# Altium project CLP.PrjPCB
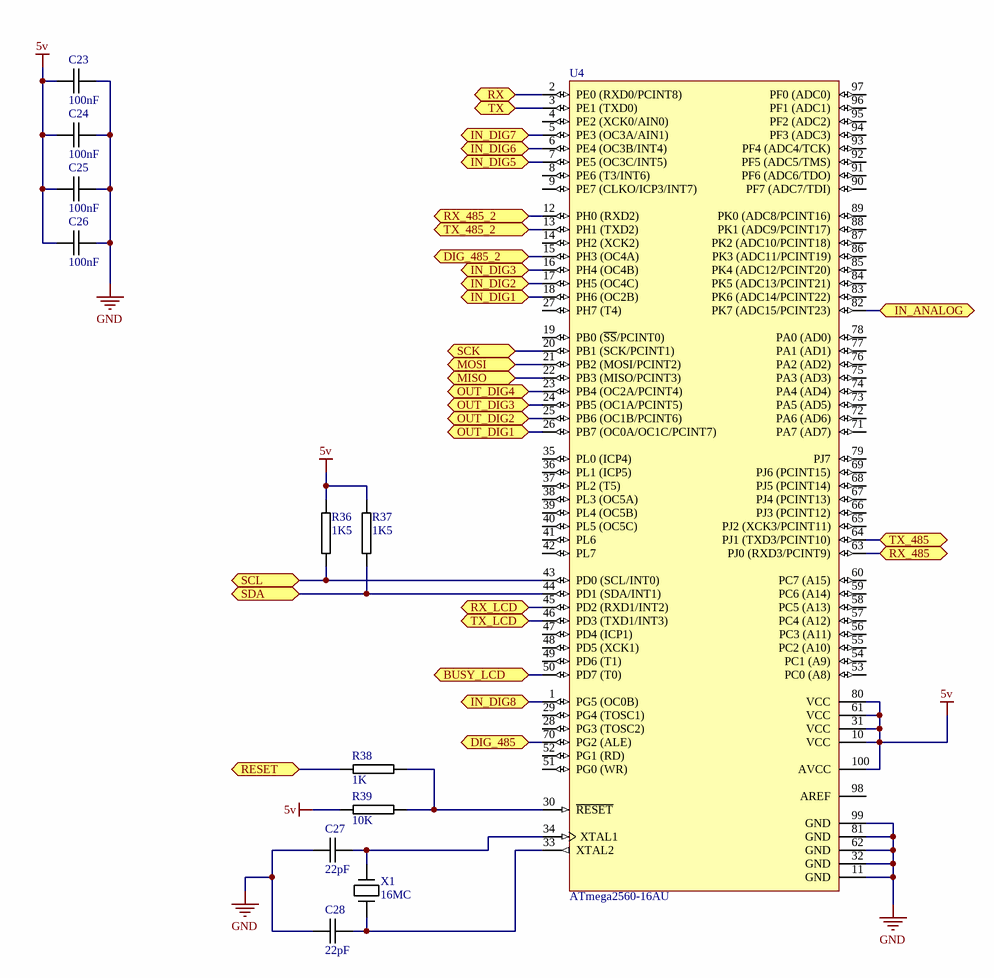
[diagram p0: Microcontrolador.SchDoc]
11 sheets, 153 parts. Net scope: flat (ports and power ports of the same name join across sheets).
Sheets:
  Microcontrolador.SchDoc
  Alimentacao.SchDoc
  Output_dig.SchDoc
  Output_dig2.SchDoc
  Input_dig.SchDoc
  Comu_485.SchDoc
  USB_SERIAL.SchDoc
  eeprom24c32.SchDoc
  RTC_ds1307z.SchDoc
  analog.SchDoc
  conn.SchDoc

## Sheet Microcontrolador.SchDoc
size A4; DocumentNumber: 1; SheetNumber: 1; SheetTotal: 11

### Parts
C23  100nF  [0805C-TBD]
C24  100nF  [0805C-TBD]
C25  100nF  [0805C-TBD]
C26  100nF  [0805C-TBD]
C27  22pF  [0603C-GENERIC]
C28  22pF  [0603C-GENERIC]
R36  1K5  [0805R-1K5]
R37  1K5  [0805R-1K5]
R38  1K  [0805R-1K]
R39  10K  [0805R-10K]
U4  ATmega2560-16AU  [100A_N]
X1  16MC  [XTAL-RU49/4]

### Ports
BUSY_LCD, DIG_485, DIG_485_2, IN_ANALOG, IN_DIG1, IN_DIG2, IN_DIG3, IN_DIG5, IN_DIG6, IN_DIG7, IN_DIG8, MISO, MOSI, OUT_DIG1, OUT_DIG2, OUT_DIG3, OUT_DIG4, RESET, RX, RX_485, RX_485_2, RX_LCD, SCK, SCL, SDA, TX, TX_485, TX_485_2, TX_LCD

### Nets
5v: C23.1 C24.1 C25.1 C26.1 R36.1 R37.1 R39.1 U4.10(VCC) U4.31(VCC) U4.61(VCC) U4.80(VCC) U4.100(AVCC)
GND: C23.2 C24.2 C25.2 C26.2 C27.1 C28.1 U4.11(GND) U4.32(GND) U4.62(GND) U4.81(GND) U4.99(GND)
NetC27_2: C27.2 U4.34(XTAL1) X1.1
NetC28_2: C28.2 U4.33(XTAL2) X1.2
NetC35_2: R38.1 ; port RESET
NetIC2_6: U4.18(PH6_(OC2B)) ; port IN_DIG1
NetIC3_6: U4.7(PE5_(OC3C/INT5)) ; port IN_DIG5
NetIC4_6: U4.17(PH5_(OC4C)) ; port IN_DIG2
NetIC5_6: U4.6(PE4_(OC3B/INT4)) ; port IN_DIG6
NetIC6_6: U4.16(PH4_(OC4B)) ; port IN_DIG3
NetIC7_6: U4.5(PE3_(OC3A/AIN1)) ; port IN_DIG7
NetIC9_6: U4.1(PG5_(OC0B)) ; port IN_DIG8
NetJ1_2: U4.22(PB3_(MISO/PCINT3)) ; port MISO
NetJ1_3: U4.21(PB2_(MOSI/PCINT2)) ; port MOSI
NetJ1_4: U4.20(PB1_(SCK/PCINT1)) ; port SCK
NetJ2_2: U4.46(PD3_(TXD1/INT3)) ; port TX_LCD
NetJ2_3: U4.45(PD2_(RXD1/INT2)) ; port RX_LCD
NetJ2_4: U4.50(PD7_(T0)) ; port BUSY_LCD
NetR36_2: R36.2 U4.43(PD0_(SCL/INT0)) ; port SCL
NetR37_2: R37.2 U4.44(PD1_(SDA/INT1)) ; port SDA
NetR38_2: R38.2 R39.2 U4.30(~{RESET})
NetR42#1_1: U4.26(PB7_(OC0A/OC1C/PCINT7)) ; port OUT_DIG1
NetR43#1_1: U4.24(PB5_(OC1A/PCINT5)) ; port OUT_DIG3
NetR48#1_1: U4.25(PB6_(OC1B/PCINT6)) ; port OUT_DIG2
NetR49#1_1: U4.23(PB4_(OC2A/PCINT4)) ; port OUT_DIG4
NetR60_2: U4.2(PE0_(RXD0/PCINT8)) ; port RX
NetR62_2: U4.3(PE1_(TXD0)) ; port TX
NetU2#1_1: U4.63(PJ0_(RXD3/PCINT9)) ; port RX_485
NetU2#1_2: U4.70(PG2_(ALE)) ; port DIG_485
NetU2#1_4: U4.64(PJ1_(TXD3/PCINT10)) ; port TX_485
NetU2#2_1: U4.12(PH0_(RXD2)) ; port RX_485_2
NetU2#2_2: U4.15(PH3_(OC4A)) ; port DIG_485_2
NetU2#2_4: U4.13(PH1_(TXD2)) ; port TX_485_2
NetU4_82: U4.82(PK7_(ADC15/PCINT23)) ; port IN_ANALOG

Not connected (* = marked no-connect by the designer): U4 4(PE2_(XCK0/AIN0)) 8(PE6_(T3/INT6)) 9(PE7_(CLKO/ICP3/INT7)) 14(PH2_(XCK2)) 19(PB0_(~{SS}/PCINT0)) 27(PH7_(T4)) 28(PG3_(TOSC2)) 29(PG4_(TOSC1)) 35(PL0_(ICP4)) 36(PL1_(ICP5)) 37(PL2_(T5)) 38(PL3_(OC5A)) 39(PL4_(OC5B)) 40(PL5_(OC5C)) 41(PL6) 42(PL7) 47(PD4_(ICP1)) 48(PD5_(XCK1)) 49(PD6_(T1)) 51(PG0_(WR)) 52(PG1_(RD)) 53(PC0_(A8)) 54(PC1_(A9)) 55(PC2_(A10)) 56(PC3_(A11)) 57(PC4_(A12)) 58(PC5_(A13)) 59(PC6_(A14)) 60(PC7_(A15)) 65(PJ2_(XCK3/PCINT11)) 66(PJ3_(PCINT12)) 67(PJ4_(PCINT13)) 68(PJ5_(PCINT14)) 69(PJ6_(PCINT15)) 71(PA7_(AD7)) 72(PA6_(AD6)) 73(PA5_(AD5)) 74(PA4_(AD4)) 75(PA3_(AD3)) 76(PA2_(AD2)) 77(PA1_(AD1)) 78(PA0_(AD0)) 79(PJ7) 83(PK6_(ADC14/PCINT22)) 84(PK5_(ADC13/PCINT21)) 85(PK4_(ADC12/PCINT20)) 86(PK3_(ADC11/PCINT19)) 87(PK2_(ADC10/PCINT18)) 88(PK1_(ADC9/PCINT17)) 89(PK0_(ADC8/PCINT16)) 90(PF7_(ADC7/TDI)) 91(PF6_(ADC6/TDO)) 92(PF5_(ADC5/TMS)) 93(PF4_(ADC4/TCK)) 94(PF3_(ADC3)) 95(PF2_(ADC2)) 96(PF1_(ADC1)) 97(PF0_(ADC0)) 98(AREF)

### Library data of the parts
C23-C26 = 0805C-100nF-25V-X7R-MUR: CAPACITOR 0805 CERAMIC; Supplier 1: Digi-Key; Supplier Part Number 1: 490-1673-1-ND
C27 C28 = 0603C-22PF-50V-C0G-PAN: CAPACITOR 0603 CERAMIC; Manufacturer Part Number: ECJ-1VC1H220J; Manufacturer: Panasonic - ECG; Reel: C10; Tolerance: ±5%; Temperature Coefficient: C0G, NP0; Voltage - Rated: 50V; Description: CAP CERAMIC 22PF 50V 0603 SMD; Supplier 1: Digi-Key; Features: General Purpose; Lead Spacing: -; Supplier: Digi-Key; Capacitance: 22pF; Packaging: Tape & Reel (TR); Mounting Type: Surface Mount, MLCC; RoHS: RoHS Compliant; Operating Temperature: -55°C ~ 125°C; Thickness: 0.80mm; Package / Case: 0603 (1608 metric); Category: Capacitors; Supplier Part Number 1: PCC220ACVTR-ND; Supplier Part Number: PCC220ACVTR-ND
R36 R37 = 0805R-1K5: RESISTOR 0805 1/4 WATT THIN FILM; Reel: *
R38 = 0805R-1K: RESISTOR 0805 1/4 WATT THIN FILM; Reel: *
R39 = 0805R-10K: RESISTOR 0805 1/4 WATT THIN FILM; Reel: *
U4 = ATmega2560-16AU: 8-bit AVR Microcontroller, 4.5-5.5V, 16MHz, 256KB Flash, 4KB EEPROM, 8KB SRAM, 86 GPIO pins, 100-pin TQFP, Industrial Grade (-40°C to 85°C), Pb-Free; DatasheetVersion: revN, May-2011; PackageVersion: revD, Oct-2010; PackageReference: 100A; PackageDescription: 100-Pin Thin Profile Plastic Quad Flat Pack (TQFP), 14 x 14 x 1.0 mm Body, 0.5 mm Pitch; Code_JEDEC: MS-026-AED; ComponentLink1Description: Manufacturer URL; ComponentLink1URL: http://www.atmel.com/; ComponentLink2Description: ATmega640/1280/1281/2560/2561 Datasheet; ComponentLink2URL: http://www.atmel.com/dyn/resources/prod_documents/doc2549.pdf; ComponentLink3Description: ATmega640/1280/1281/2560/2561 Summary; ComponentLink3URL: http://www.atmel.com/dyn/resources/prod_documents/2549S.pdf
X1 = 16MC-HC49US: 16MHZ CRSYTAL HC49US; Supplier 1: Mouser; Supplier Part Number 1: 815-ABLS-16.0M-T

## Sheet Alimentacao.SchDoc
size A4; DocumentNumber: 8; SheetNumber: 8; SheetTotal: 11

## Sheet Output_dig.SchDoc
size A4; DocumentNumber: 2; SheetNumber: 2; SheetTotal: 11
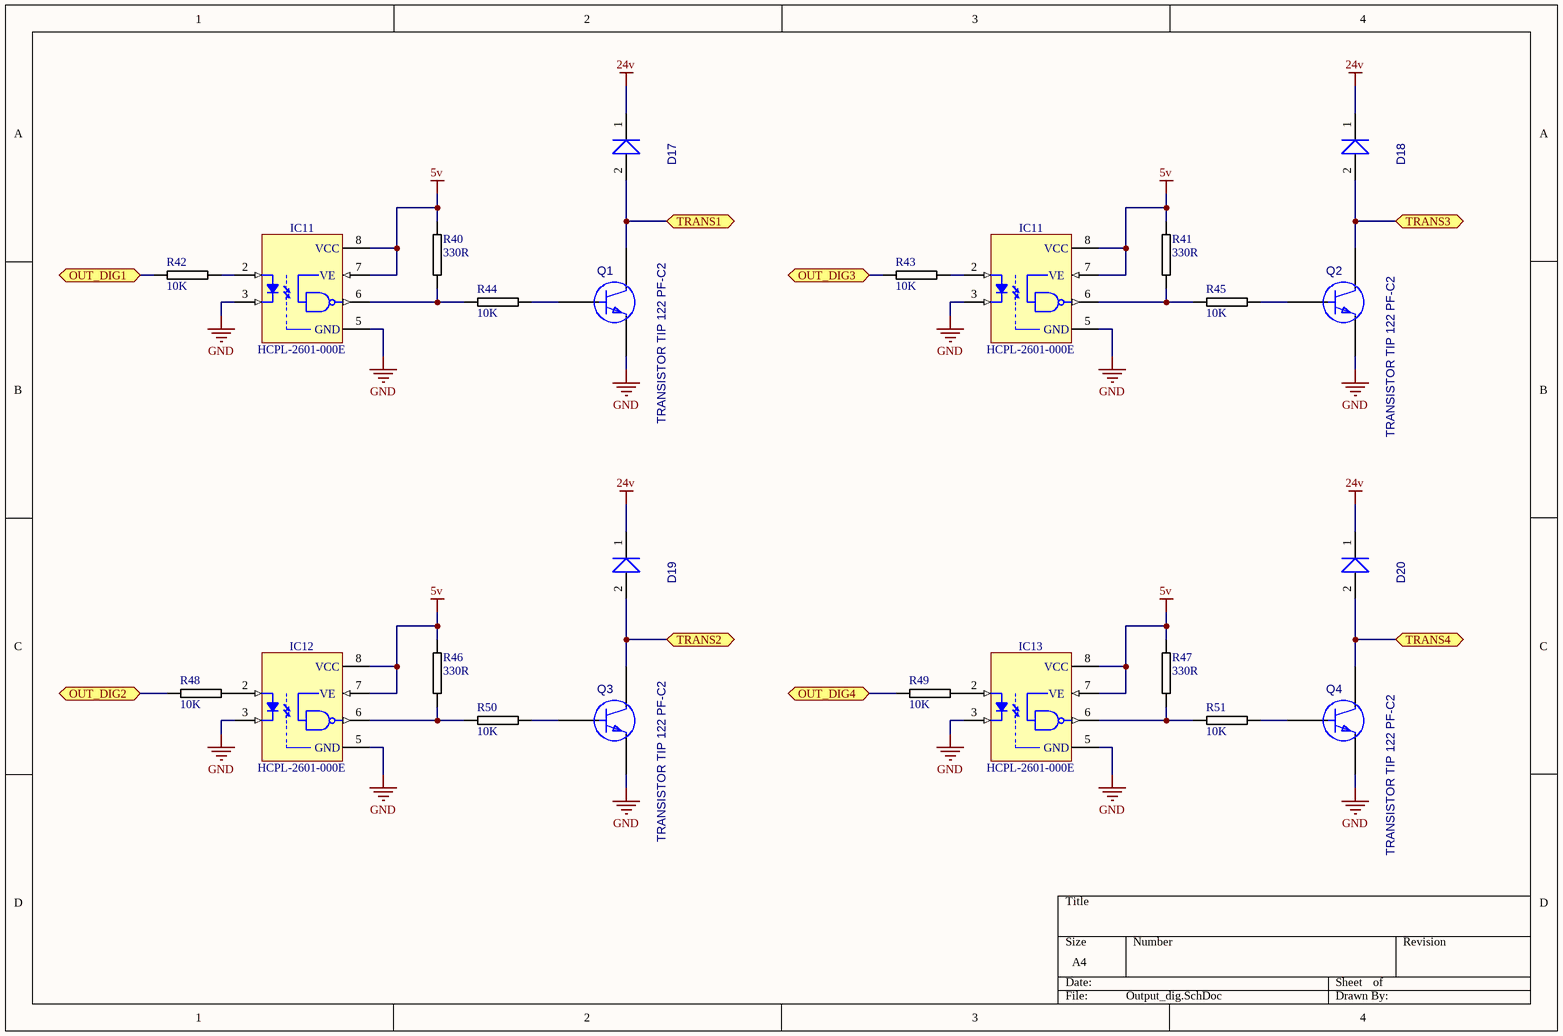
[diagram p1: Output_dig.SchDoc]

### Parts
(Parts that share a designator on the sheet are numbered #1, #2 ... from top to bottom, then left to right.)
D17#1  DIODO 1N4007 PF-B1  [DIODO DO41 PF-B1]  (value not drawn)
D18#1  DIODO 1N4007 PF-B1  [DIODO DO41 PF-B1]  (value not drawn)
D19#1  DIODO 1N4007 PF-B1  [DIODO DO41 PF-B1]  (value not drawn)
D20#1  DIODO 1N4007 PF-B1  [DIODO DO41 PF-B1]  (value not drawn)
IC11#1  HCPL-2601-000E  [DIP8-300]
IC11#2  HCPL-2601-000E  [DIP8-300]
IC12#1  HCPL-2601-000E  [DIP8-300]
IC13#1  HCPL-2601-000E  [DIP8-300]
Q1#1  TRANSISTOR TIP 122 PF-C2  [TRANSISTOR TO220 PF-C2]
Q2#1  TRANSISTOR TIP 122 PF-C2  [TRANSISTOR TO220 PF-C2]
Q3#1  TRANSISTOR TIP 122 PF-C2  [TRANSISTOR TO220 PF-C2]
Q4#1  TRANSISTOR TIP 122 PF-C2  [TRANSISTOR TO220 PF-C2]
R40#1  330R  [0805R-330]
R41#1  330R  [0805R-330]
R42#1  10K  [0805R-10K]
R43#1  10K  [0805R-10K]
R44#1  10K  [0805R-10K]
R45#1  10K  [0805R-10K]
R46#1  330R  [0805R-330]
R47#1  330R  [0805R-330]
R48#1  10K  [0805R-10K]
R49#1  10K  [0805R-10K]
R50#1  10K  [0805R-10K]
R51#1  10K  [0805R-10K]

### Ports
OUT_DIG1, OUT_DIG2, OUT_DIG3, OUT_DIG4, TRANS1, TRANS2, TRANS3, TRANS4

### Nets
5v: IC11#1.7(VE) IC11#1.8(VCC) IC11#2.7(VE) IC11#2.8(VCC) IC12#1.7(VE) IC12#1.8(VCC) IC13#1.7(VE) IC13#1.8(VCC) R40#1.1 R41#1.1 R46#1.1 R47#1.1
24v: D17#1.1(K) D18#1.1(K) D19#1.1(K) D20#1.1(K)
GND: IC11#1.3(K) IC11#1.5(GND) IC11#2.3(K) IC11#2.5(GND) IC12#1.3(K) IC12#1.5(GND) IC13#1.3(K) IC13#1.5(GND) Q1#1.3(E) Q2#1.3(E) Q3#1.3(E) Q4#1.3(E)
NetD17#1_2: D17#1.2(A) Q1#1.2(C) ; port TRANS1
NetD18#1_2: D18#1.2(A) Q2#1.2(C) ; port TRANS3
NetD19#1_2: D19#1.2(A) Q3#1.2(C) ; port TRANS2
NetD20#1_2: D20#1.2(A) Q4#1.2(C) ; port TRANS4
NetIC11#1_2: IC11#1.2(A) R42#1.2
NetIC11#1_6: IC11#1.6(VO) R40#1.2 R44#1.1
NetIC11#2_2: IC11#2.2(A) R43#1.2
NetIC11#2_6: IC11#2.6(VO) R41#1.2 R45#1.1
NetIC12#1_2: IC12#1.2(A) R48#1.2
NetIC12#1_6: IC12#1.6(VO) R46#1.2 R50#1.1
NetIC13#1_2: IC13#1.2(A) R49#1.2
NetIC13#1_6: IC13#1.6(VO) R47#1.2 R51#1.1
NetQ1#1_1: Q1#1.1(B) R44#1.2
NetQ2#1_1: Q2#1.1(B) R45#1.2
NetQ3#1_1: Q3#1.1(B) R50#1.2
NetQ4#1_1: Q4#1.1(B) R51#1.2
NetR42#1_1: R42#1.1 ; port OUT_DIG1
NetR43#1_1: R43#1.1 ; port OUT_DIG3
NetR48#1_1: R48#1.1 ; port OUT_DIG2
NetR49#1_1: R49#1.1 ; port OUT_DIG4

### Library data of the parts
D17#1 D18#1 D19#1 D20#1 = DIODO 1N4007 PF-B1: cod: 606000120; Compra: 302003193; 3D comp: DIODO DO41 PF-B1; Descri: DIODO 1N4007 PF-B1; SCH: DIODO 1N4007 PF-B1
IC11#1 IC11#2 IC12#1 IC13#1 = HCPL-2601-000E: Single Optocoupler; Part Description: High CMR, High Speed TTL Compatible Optocouplers; Manufacturer: AVAGO TECHNOLOGIES; Table: Optocouplers; Part Number: HCPL-2601-000E; Component Kind: Standard; Component Type: Standard; Device: HCPL-2601-000E; PackageDescription: DIP; 8 Leads; Row Spacing 7.62 mm; Pitch 2.54 mm; Manufacturer Part Number: HCPL-2601-000E; Pin Count: 8; Case: DIP8-300; Mounted: Yes; Socket: Yes; SMD: No; ComponentHeight: 4.7mm; HelpURL: \\cern.ch\dfs\Applications\Altium\Datasheets\HCPL-2601-000E.pdf; Author: CERN DEM JLC; CreateDate: 30/03/2009; LatestRevisionDate: 30/03/2009
Q1#1 Q2#1 Q3#1 Q4#1 = TRANSISTOR TIP 122 PF-C2: cod: 606000213; Compra: 302003328; 3D comp: TRANSISTOR TO220 PF-C2; Descri: TRANSISTOR TIP 122 PF-C2; SCH: TRANSISTOR TIP 122 PF-C2
R40#1 R41#1 R46#1 R47#1 = 0805R-330: RESISTOR 0805 1/4 WATT THIN FILM; Reel: *
R42#1 R43#1 R44#1 R45#1 R48#1 R49#1 R50#1 R51#1 = 0805R-10K: RESISTOR 0805 1/4 WATT THIN FILM; Reel: *

## Sheet Output_dig2.SchDoc
size A4
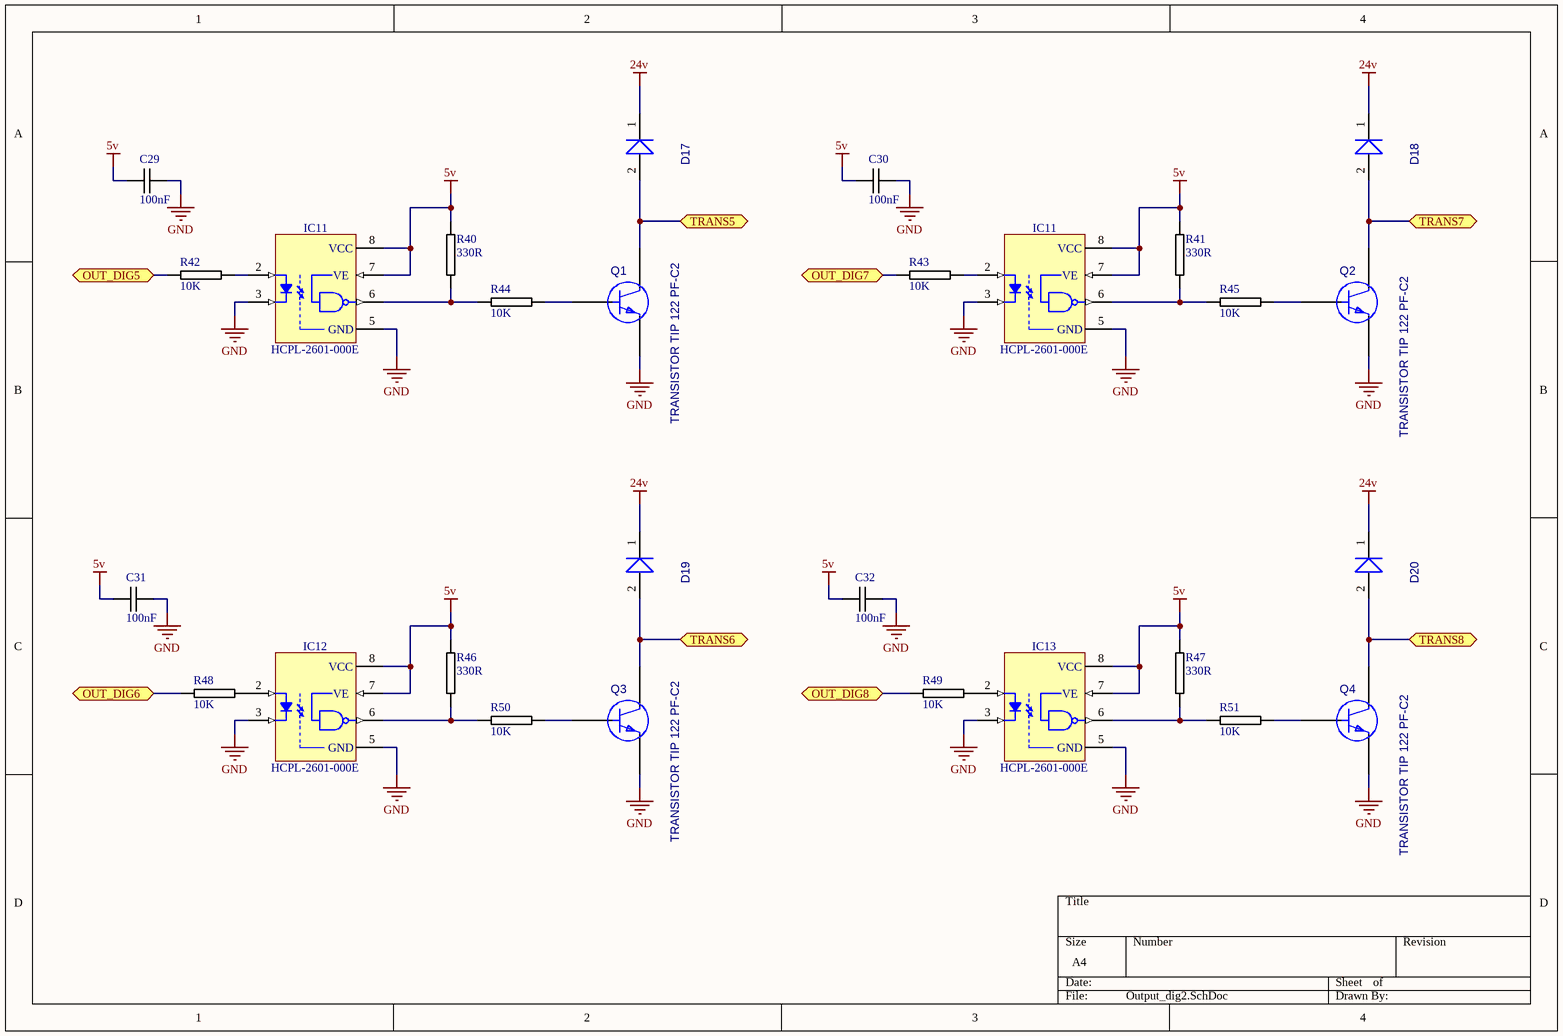
[diagram p2: Output_dig2.SchDoc]

### Parts
(Parts that share a designator on the sheet are numbered #1, #2 ... from top to bottom, then left to right.)
C29  100nF  [0805C-TBD]
C30  100nF  [0805C-TBD]
C31  100nF  [0805C-TBD]
C32  100nF  [0805C-TBD]
D17#2  DIODO 1N4007 PF-B1  [DIODO DO41 PF-B1]  (value not drawn)
D18#2  DIODO 1N4007 PF-B1  [DIODO DO41 PF-B1]  (value not drawn)
D19#2  DIODO 1N4007 PF-B1  [DIODO DO41 PF-B1]  (value not drawn)
D20#2  DIODO 1N4007 PF-B1  [DIODO DO41 PF-B1]  (value not drawn)
IC11#3  HCPL-2601-000E  [DIP8-300]
IC11#4  HCPL-2601-000E  [DIP8-300]
IC12#2  HCPL-2601-000E  [DIP8-300]
IC13#2  HCPL-2601-000E  [DIP8-300]
Q1#2  TRANSISTOR TIP 122 PF-C2  [TRANSISTOR TO220 PF-C2]
Q2#2  TRANSISTOR TIP 122 PF-C2  [TRANSISTOR TO220 PF-C2]
Q3#2  TRANSISTOR TIP 122 PF-C2  [TRANSISTOR TO220 PF-C2]
Q4#2  TRANSISTOR TIP 122 PF-C2  [TRANSISTOR TO220 PF-C2]
R40#2  330R  [0805R-330]
R41#2  330R  [0805R-330]
R42#2  10K  [0805R-10K]
R43#2  10K  [0805R-10K]
R44#2  10K  [0805R-10K]
R45#2  10K  [0805R-10K]
R46#2  330R  [0805R-330]
R47#2  330R  [0805R-330]
R48#2  10K  [0805R-10K]
R49#2  10K  [0805R-10K]
R50#2  10K  [0805R-10K]
R51#2  10K  [0805R-10K]

### Ports
OUT_DIG5, OUT_DIG6, OUT_DIG7, OUT_DIG8, TRANS5, TRANS6, TRANS7, TRANS8

### Nets
5v: C29.1 C30.1 C31.1 C32.1 IC11#3.7(VE) IC11#3.8(VCC) IC11#4.7(VE) IC11#4.8(VCC) IC12#2.7(VE) IC12#2.8(VCC) IC13#2.7(VE) IC13#2.8(VCC) R40#2.1 R41#2.1 R46#2.1 R47#2.1
24v: D17#2.1(K) D18#2.1(K) D19#2.1(K) D20#2.1(K)
GND: C29.2 C30.2 C31.2 C32.2 IC11#3.3(K) IC11#3.5(GND) IC11#4.3(K) IC11#4.5(GND) IC12#2.3(K) IC12#2.5(GND) IC13#2.3(K) IC13#2.5(GND) Q1#2.3(E) Q2#2.3(E) Q3#2.3(E) Q4#2.3(E)
NetD17#2_2: D17#2.2(A) Q1#2.2(C) ; port TRANS5
NetD18#2_2: D18#2.2(A) Q2#2.2(C) ; port TRANS7
NetD19#2_2: D19#2.2(A) Q3#2.2(C) ; port TRANS6
NetD20#2_2: D20#2.2(A) Q4#2.2(C) ; port TRANS8
NetIC11#3_2: IC11#3.2(A) R42#2.2
NetIC11#3_6: IC11#3.6(VO) R40#2.2 R44#2.1
NetIC11#4_2: IC11#4.2(A) R43#2.2
NetIC11#4_6: IC11#4.6(VO) R41#2.2 R45#2.1
NetIC12#2_2: IC12#2.2(A) R48#2.2
NetIC12#2_6: IC12#2.6(VO) R46#2.2 R50#2.1
NetIC13#2_2: IC13#2.2(A) R49#2.2
NetIC13#2_6: IC13#2.6(VO) R47#2.2 R51#2.1
NetQ1#2_1: Q1#2.1(B) R44#2.2
NetQ2#2_1: Q2#2.1(B) R45#2.2
NetQ3#2_1: Q3#2.1(B) R50#2.2
NetQ4#2_1: Q4#2.1(B) R51#2.2
NetR42#2_1: R42#2.1 ; port OUT_DIG5
NetR43#2_1: R43#2.1 ; port OUT_DIG7
NetR48#2_1: R48#2.1 ; port OUT_DIG6
NetR49#2_1: R49#2.1 ; port OUT_DIG8

### Library data of the parts
C29-C32 = 0805C-100nF-25V-X7R-MUR: CAPACITOR 0805 CERAMIC; Supplier 1: Digi-Key; Supplier Part Number 1: 490-1673-1-ND
D17#2 D18#2 D19#2 D20#2 = DIODO 1N4007 PF-B1: cod: 606000120; Compra: 302003193; 3D comp: DIODO DO41 PF-B1; Descri: DIODO 1N4007 PF-B1; SCH: DIODO 1N4007 PF-B1
IC11#3 IC11#4 IC12#2 IC13#2 = HCPL-2601-000E: as IC11#1 on sheet Output_dig; Part Number: HCPL-2601-000E; Component Kind: Standard; Component Type: Standard; Device: HCPL-2601-000E; PackageDescription: DIP; 8 Leads; Row Spacing 7.62 mm; Pitch 2.54 mm; Manufacturer Part Number: HCPL-2601-000E; Pin Count: 8; Case: DIP8-300; Mounted: Yes; Socket: Yes; SMD: No; ComponentHeight: 4.7mm; HelpURL: \\cern.ch\dfs\Applications\Altium\Datasheets\HCPL-2601-000E.pdf; Author: CERN DEM JLC; CreateDate: 30/03/2009; LatestRevisionDate: 30/03/2009
Q1#2 Q2#2 Q3#2 Q4#2 = TRANSISTOR TIP 122 PF-C2: cod: 606000213; Compra: 302003328; 3D comp: TRANSISTOR TO220 PF-C2; Descri: TRANSISTOR TIP 122 PF-C2; SCH: TRANSISTOR TIP 122 PF-C2
R40#2 R41#2 R46#2 R47#2 = 0805R-330: RESISTOR 0805 1/4 WATT THIN FILM; Reel: *
R42#2 R43#2 R44#2 R45#2 R48#2 R49#2 R50#2 R51#2 = 0805R-10K: RESISTOR 0805 1/4 WATT THIN FILM; Reel: *

## Sheet Input_dig.SchDoc
size A4; DocumentNumber: 3; SheetNumber: 3; SheetTotal: 11
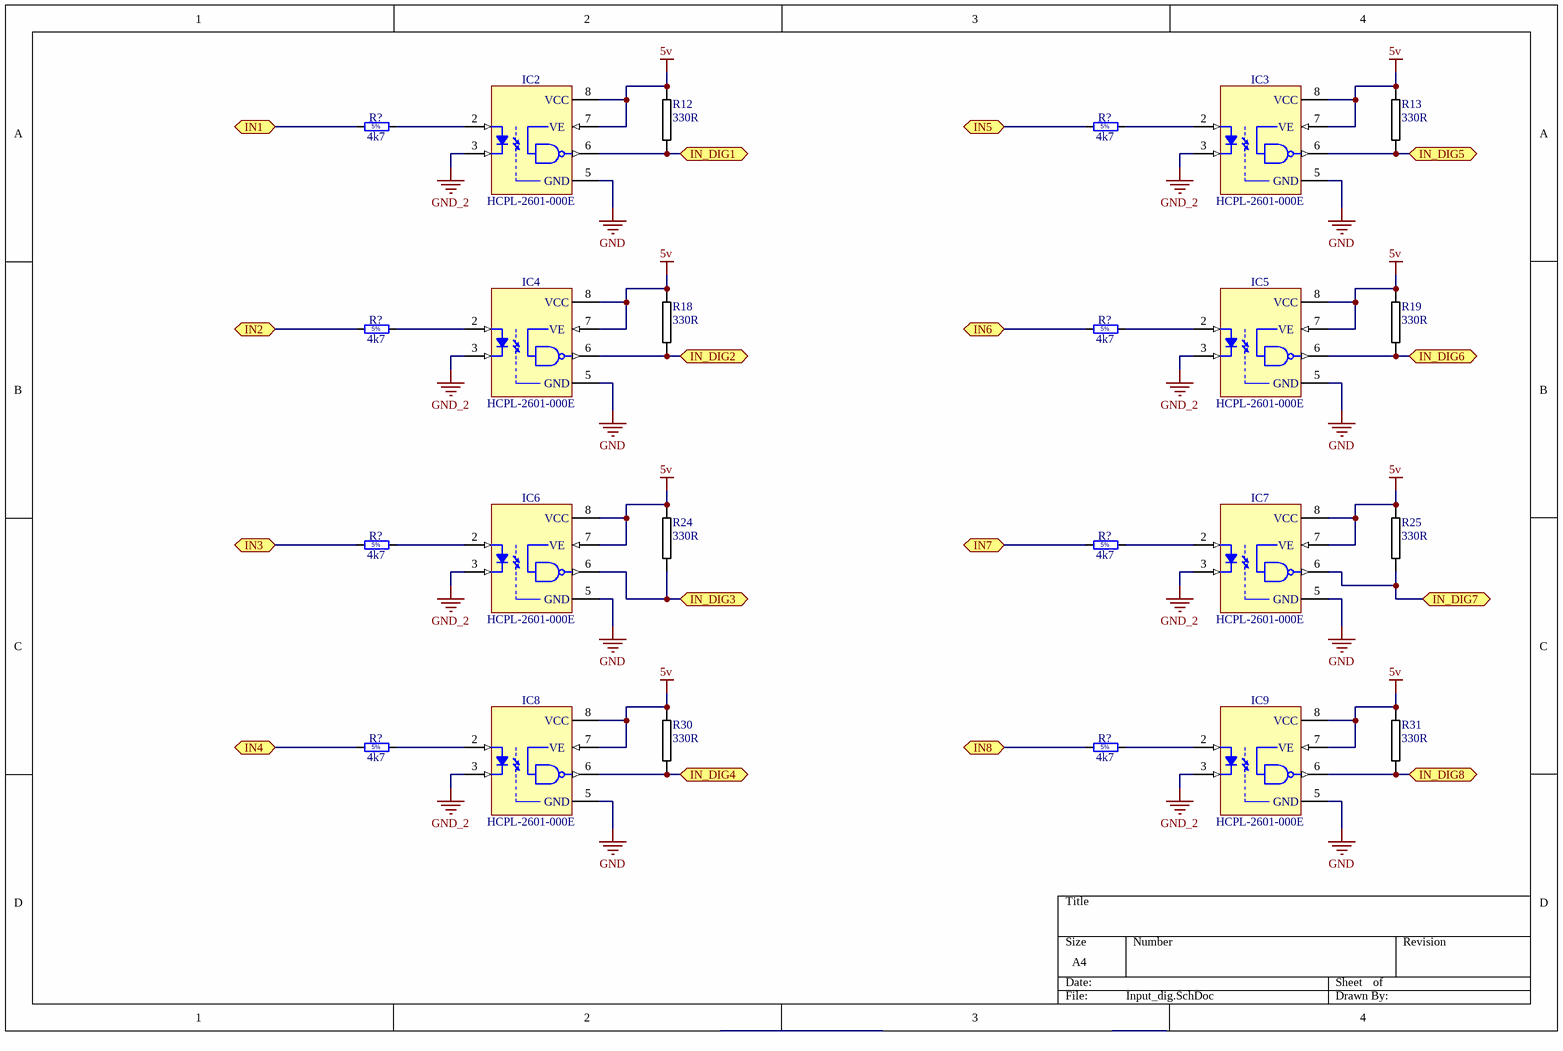
[diagram p3: Input_dig.SchDoc]

### Parts
(Parts that share a designator on the sheet are numbered #1, #2 ... from top to bottom, then left to right.)
IC2  HCPL-2601-000E  [DIP8-300]
IC3  HCPL-2601-000E  [DIP8-300]
IC4  HCPL-2601-000E  [DIP8-300]
IC5  HCPL-2601-000E  [DIP8-300]
IC6  HCPL-2601-000E  [DIP8-300]
IC7  HCPL-2601-000E  [DIP8-300]
IC8  HCPL-2601-000E  [DIP8-300]
IC9  HCPL-2601-000E  [DIP8-300]
R12  330R  [0805R-330]
R13  330R  [0805R-330]
R18  330R  [0805R-330]
R19  330R  [0805R-330]
R24  330R  [0805R-330]
R25  330R  [0805R-330]
R30  330R  [0805R-330]
R31  330R  [0805R-330]
R?#1  4k7  [RES2286-1670X520]
R?#2  4k7  [RES2286-1670X520]
R?#3  4k7  [RES2286-1670X520]
R?#4  4k7  [RES2286-1670X520]
R?#5  4k7  [RES2286-1670X520]
R?#6  4k7  [RES2286-1670X520]
R?#7  4k7  [RES2286-1670X520]
R?#8  4k7  [RES2286-1670X520]

### Ports
IN1, IN2, IN3, IN4, IN5, IN6, IN7, IN8, IN_DIG1, IN_DIG2, IN_DIG3, IN_DIG4, IN_DIG5, IN_DIG6, IN_DIG7, IN_DIG8

### Nets
5v: IC2.7(VE) IC2.8(VCC) IC3.7(VE) IC3.8(VCC) IC4.7(VE) IC4.8(VCC) IC5.7(VE) IC5.8(VCC) IC6.7(VE) IC6.8(VCC) IC7.7(VE) IC7.8(VCC) IC8.7(VE) IC8.8(VCC) IC9.7(VE) IC9.8(VCC) R12.1 R13.1 R18.1 R19.1 R24.1 R25.1 R30.1 R31.1
GND: IC2.5(GND) IC3.5(GND) IC4.5(GND) IC5.5(GND) IC6.5(GND) IC7.5(GND) IC8.5(GND) IC9.5(GND)
GND_2: IC2.3(K) IC3.3(K) IC4.3(K) IC5.3(K) IC6.3(K) IC7.3(K) IC8.3(K) IC9.3(K)
NetIC2_2: IC2.2(A) R?#1.2
NetIC2_6: IC2.6(VO) R12.2 ; port IN_DIG1
NetIC3_2: IC3.2(A) R?#2.2
NetIC3_6: IC3.6(VO) R13.2 ; port IN_DIG5
NetIC4_2: IC4.2(A) R?#3.2
NetIC4_6: IC4.6(VO) R18.2 ; port IN_DIG2
NetIC5_2: IC5.2(A) R?#4.2
NetIC5_6: IC5.6(VO) R19.2 ; port IN_DIG6
NetIC6_2: IC6.2(A) R?#5.2
NetIC6_6: IC6.6(VO) R24.2 ; port IN_DIG3
NetIC7_2: IC7.2(A) R?#6.2
NetIC7_6: IC7.6(VO) R25.2 ; port IN_DIG7
NetIC8_2: IC8.2(A) R?#7.2
NetIC8_6: IC8.6(VO) R30.2 ; port IN_DIG4
NetIC9_2: IC9.2(A) R?#8.2
NetIC9_6: IC9.6(VO) R31.2 ; port IN_DIG8
NetJ9#1_3: R?#8.1 ; port IN8
NetJ9#1_4: R?#6.1 ; port IN7
NetJ9#1_5: R?#4.1 ; port IN6
NetJ9#1_6: R?#2.1 ; port IN5
NetJ9#1_7: R?#7.1 ; port IN4
NetJ9#1_8: R?#5.1 ; port IN3
NetJ9#1_9: R?#3.1 ; port IN2
NetJ9#1_10: R?#1.1 ; port IN1

### Notes on the sheet
- (in symbol RMF_4K7_5%_3W_250PPM_2286-1670X520) 5%

### Library data of the parts
IC2-IC9 = HCPL-2601-000E: as IC11#1 on sheet Output_dig; Part Number: HCPL-2601-000E; Component Kind: Standard; Component Type: Standard; Device: HCPL-2601-000E; PackageDescription: DIP; 8 Leads; Row Spacing 7.62 mm; Pitch 2.54 mm; Manufacturer Part Number: HCPL-2601-000E; Pin Count: 8; Case: DIP8-300; Mounted: Yes; Socket: Yes; SMD: No; ComponentHeight: 4.7mm; HelpURL: \\cern.ch\dfs\Applications\Altium\Datasheets\HCPL-2601-000E.pdf; Author: CERN DEM JLC; CreateDate: 30/03/2009; LatestRevisionDate: 30/03/2009
R12 R13 R18 R19 R24 R25 R30 R31 = 0805R-330: RESISTOR 0805 1/4 WATT THIN FILM; Reel: *
R?#1-R?#8 = RMF_4K7_5%_3W_250PPM_2286-1670X520: Resistor - 5%; Part Description: Leaded Power Metal Film Resistor; Manufacturer: GENERIC; Manufacturer1 Part Number: PR03000204701JAC00; Power: 3W; TC: ±250ppm/°C; Table: Resistors THD; Part Number: RMF_4K7_5%_3W_250PPM_2286-1670X520; Component Kind: Standard; Component Type: Standard; Pin Count: 2; Value: 4k7; Status: Preferred; Tolerance: ±5%; Manufacturer Part Number: RMF_4K7_5%_3W_250PPM_2286-1670X520; Case: LS22.86 L16.7 x D5.2; Mounted: Yes; Socket: No; SMD: No; ComponentHeight: 5.2mm; Manufacturer1 Example: VISHAY BCCOMPONENT; Manufacturer1 ComponentHeight: 5.2mm; HelpURL: \\cern.ch\dfs\Applications\Altium\Datasheets\RMF_VISHAY_PR03.pdf; Author: CERN DEM JLC; CreateDate: 19/06/2008; LatestRevisionDate: 01/10/2012

## Sheet Comu_485.SchDoc
size A4; DocumentNumber: 5; SheetNumber: 5; SheetTotal: 11
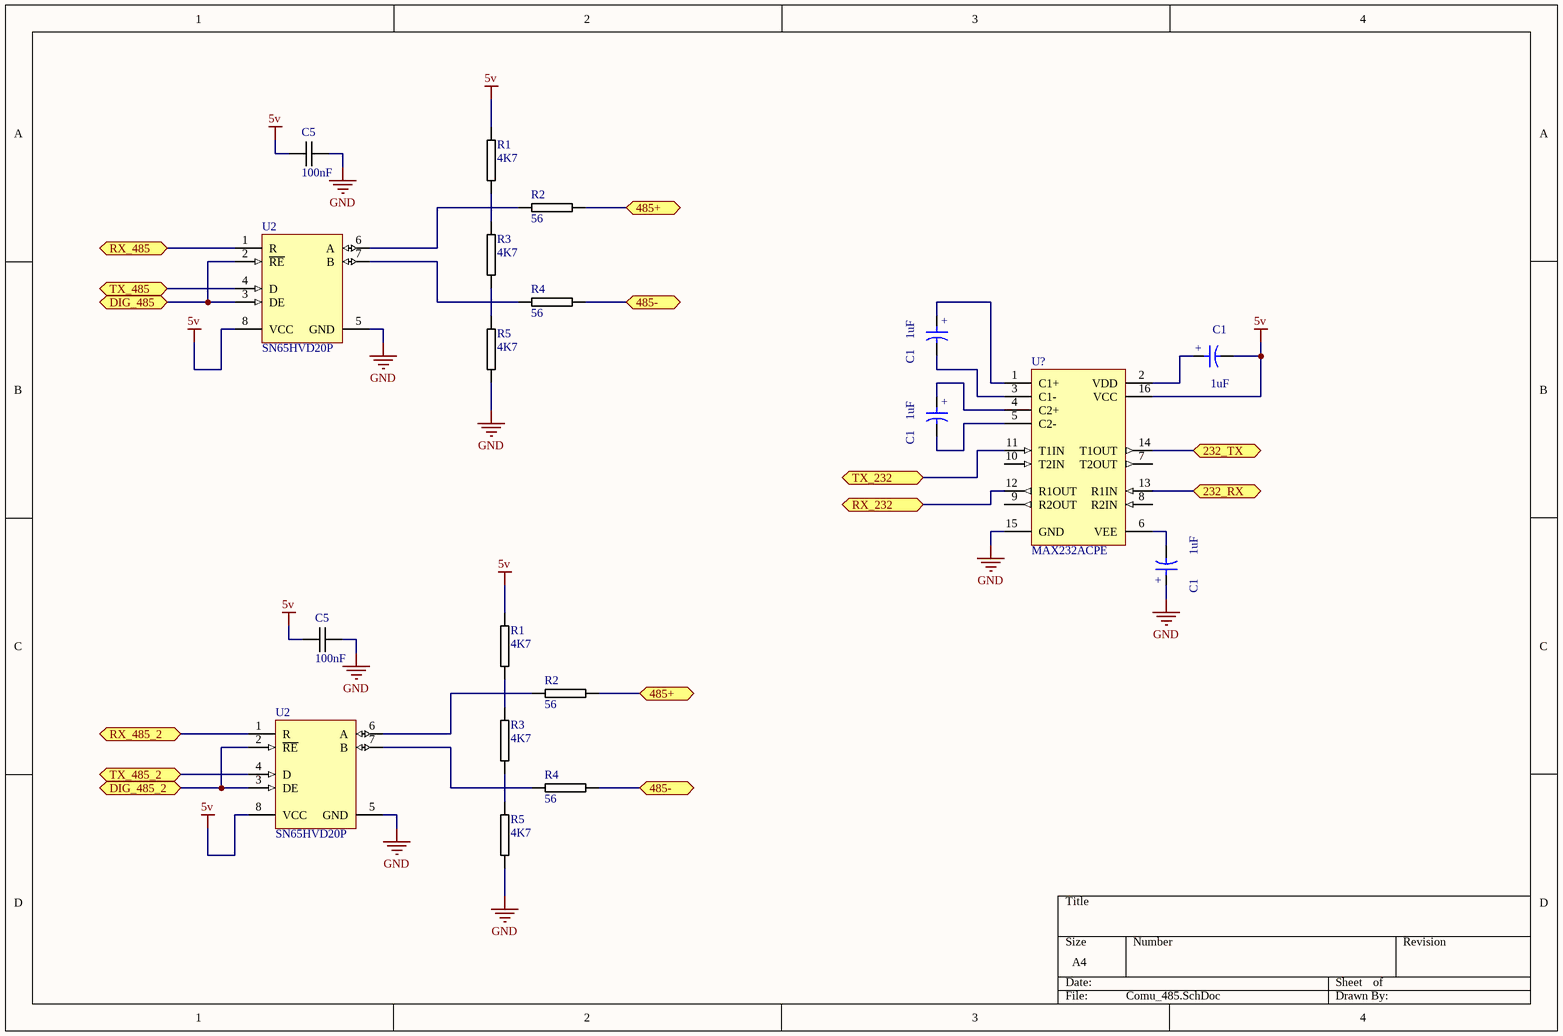
[diagram p4: Comu_485.SchDoc]

### Parts
(Parts that share a designator on the sheet are numbered #1, #2 ... from top to bottom, then left to right.)
C1#1  1uF  [CAPPRB254-450X710]
C1#2  1uF  [CAPPRB254-450X710]
C1#3  1uF  [CAPPRB254-450X710]
C1#4  1uF  [CAPPRB254-450X710]
C5#1  100nF  [0805C-TBD]
C5#2  100nF  [0805C-TBD]
R1#1  4K7  [0805R-4K7]
R1#2  4K7  [0805R-4K7]
R2#1  56  [0805R-56]
R2#2  56  [0805R-56]
R3#1  4K7  [0805R-4K7]
R3#2  4K7  [0805R-4K7]
R4#1  56  [0805R-56]
R4#2  56  [0805R-56]
R5#1  4K7  [0805R-4K7]
R5#2  4K7  [0805R-4K7]
U2#1  SN65HVD20P  [P8]
U2#2  SN65HVD20P  [P8]
U?  MAX232ACPE  [PE16A]

### Ports
232_RX, 232_TX, 485+, 485-, DIG_485 (bidir), DIG_485_2 (bidir), RX_232, RX_485, RX_485_2, TX_232, TX_485 (bidir), TX_485_2 (bidir)

### Nets
5v: C1#2.2 C5#1.1 C5#2.1 R1#1.1 R1#2.1 U2#1.8(VCC) U2#2.8(VCC) U?.16(VCC)
GND: C1#4.1 C5#1.2 C5#2.2 R5#1.2 R5#2.2 U2#1.5(GND) U2#2.5(GND) U?.15(GND)
NetC1#1_1: C1#1.1 U?.1(C1+)
NetC1#1_2: C1#1.2 U?.3(C1-)
NetC1#2_1: C1#2.1 U?.2(VDD)
NetC1#3_1: C1#3.1 U?.4(C2+)
NetC1#3_2: C1#3.2 U?.5(C2-)
NetC1#4_2: C1#4.2 U?.6(VEE)
NetJ7_1: R2#1.2 R2#2.2 ; port 485+
NetJ7_2: R4#1.2 R4#2.2 ; port 485-
NetR1#1_2: R1#1.2 R3#1.1
NetR1#2_2: R1#2.2 R3#2.1
NetR2#1_1: R2#1.1 U2#1.6(A)
NetR2#2_1: R2#2.1 U2#2.6(A)
NetR3#1_2: R3#1.2 R5#1.1
NetR3#2_2: R3#2.2 R5#2.1
NetR4#1_1: R4#1.1 U2#1.7(B)
NetR4#2_1: R4#2.1 U2#2.7(B)
NetU2#1_1: U2#1.1(R) ; port RX_485
NetU2#1_2: U2#1.2(~{RE}) U2#1.3(DE) ; port DIG_485
NetU2#1_4: U2#1.4(D) ; port TX_485
NetU2#2_1: U2#2.1(R) ; port RX_485_2
NetU2#2_2: U2#2.2(~{RE}) U2#2.3(DE) ; port DIG_485_2
NetU2#2_4: U2#2.4(D) ; port TX_485_2
NetU?_11: U?.11(T1IN) ; port TX_232
NetU?_12: U?.12(R1OUT) ; port RX_232
NetU?_13: U?.13(R1IN) ; port 232_RX
NetU?_14: U?.14(T1OUT) ; port 232_TX

Not connected (* = marked no-connect by the designer): U? 7(T2OUT) 8(R2IN) 9(R2OUT) 10(T2IN)

### Notes on the sheet
- (in symbol CTEB_1UF_35V_10%_254-450X710) +

### Library data of the parts
C1#1-C1#4 = CTEB_1UF_35V_10%_254-450X710: Polarised capacitor; Part Description: Solid Tantalum Resin Dipped Capacitor; Manufacturer: KEMET; Manufacturer Part Number: T350A105K035AT; Voltage: 35V; Tolerance: ±10%; Table: Capacitors THD; Part Number: CTEB_1UF_35V_10%_254-450X710; Component Kind: Standard; Component Type: Standard; Pin Count: 2; Value: 1uF; Status: None; Case: LS2.54 D4.5 x H7.1; Mounted: Yes; Socket: No; SMD: No; ComponentHeight: 7.1mm; HelpURL: \\cern.ch\dfs\Applications\Altium\Datasheets\CTEB_KEMET_T350.pdf; Author: CERN DEM JLC; CreateDate: 16/12/2009; LatestRevisionDate: 16/12/2009
C5#1 C5#2 = 0805C-100nF-25V-X7R-MUR: CAPACITOR 0805 CERAMIC; Supplier 1: Digi-Key; Supplier Part Number 1: 490-1673-1-ND
R1#1 R1#2 R3#1 R3#2 R5#1 R5#2 = 0805R-4K7: RESISTOR 0805 1/4 WATT THIN FILM; Reel: *
R2#1 R2#2 R4#1 R4#2 = 0805R-56: RESISTOR 0805 1/4 WATT THIN FILM; Reel: *
U2#1 U2#2 = SN65HVD20P: Extended Common-mode RS-485 Transceiver, 25 Mbps, 5 V, Half Duplex, -40 to 85 degC, 8-pin PDIP (P), Pb-Free (RoHS); Manufacturer: Texas Instruments; Eco-Plan: Green (RoHS & no Sb/Br); # of TX/RX: 1 TX / 1 RX; Drivers Per Package: 1; Isolated: No; Number of Nodes: 64; Signaling Rate(Mbps): 25; Common Mode Range: -20 to 25; ESD(kV): 16; Fault Protection(V): -27 to 27; Fail Safe: Idle, Open, Short; ICC(Max)(mA): 9; Supply Voltage(s)(V): 5; Rating: Catalog; DatasheetVersion: SLLS552E; PackageVersion: revE, Apr-2010; PackageReference: P8; PackageDescription: 8-Pin Plastic Dual-In-Line Package, Row Spacing 7.62 mm, Pitch 2.54 mm; Supplier 1: Digi-Key; Supplier Part Number 1: SN65HVD20P-ND; Supplier 2: Mouser; Supplier Part Number 2: 595-SN65HVD20P; SubFamily: RS-485; Receivers Per Package: 1; Duplex: Half; Footprint: SN75176; Mounting Technology: Through-hole; PartNumber: SN65HVD20P; Code_JEDEC: MS-001-BA; ComponentLink1Description: Datasheet; ComponentLink1URL: http://www.ti.com/general/docs/lit/getliterature.tsp?genericPartNumber=SN65HVD20&fileType=pdf; ComponentLink2Description: Package Specification; ComponentLink2URL: http://www.ti.com/litv/pdf/mpdi001b
U? = MAX232ACPE: +5V Powered, Multi-Channel RS-232 Driver/Receiver; Published: 16-Jan-2001; LatestRevisionDate: 29-May-2009; LatestRevisionNote: Component Body Added.; PackageVersion: 1997; PackageReference: PE16A; Publisher: Altium Limited; PackageDescription: DIP, 16-Pin, Row Spacing 7.62 mm, Pitch 2.54 mm; Code_JEDEC: MS-001-BB; ComponentLink1Description: Manufacturer Link; ComponentLink1URL: http://www.maxim-ic.com/; ComponentLink2Description: Datasheet; ComponentLink2URL: http://pdfserv.maxim-ic.com/en/ds/MAX220-MAX249.pdf

## Sheet USB_SERIAL.SchDoc
size A4; DocumentNumber: 6; SheetNumber: 6; SheetTotal: 11
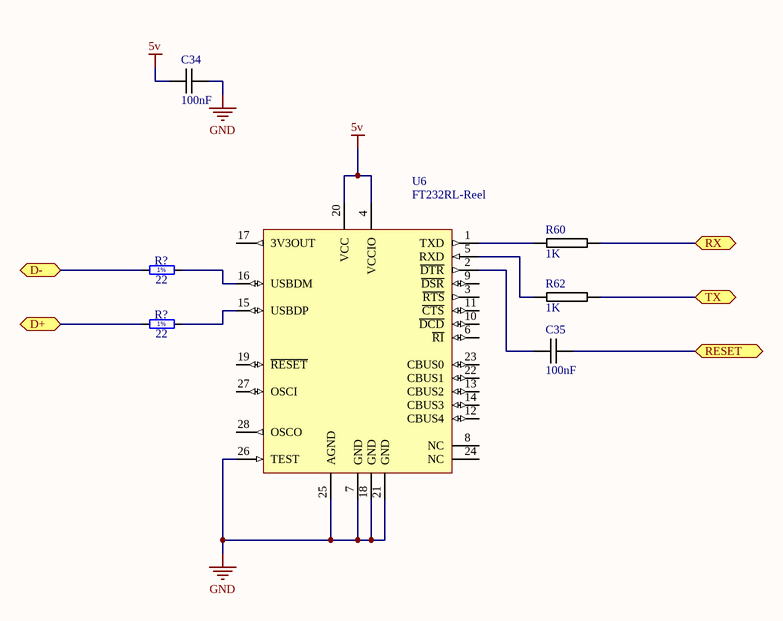
[diagram p5: USB_SERIAL.SchDoc]

### Parts
(Parts that share a designator on the sheet are numbered #1, #2 ... from top to bottom, then left to right.)
C34  100nF  [0805C-TBD]
C35  100nF  [0805C-TBD]
R60  1K  [0805R-1K]
R62  1K  [0805R-1K]
R?#9  22  [RESC2012X60N]
R?#10  22  [RESC2012X60N]
U6  FT232RL-Reel  [SSOP-28_N]

### Ports
D+, D-, RESET, RX, TX

### Nets
5v: C34.1 U6.4(VCCIO) U6.20(VCC)
GND: C34.2 U6.7(GND) U6.18(GND) U6.21(GND) U6.25(AGND) U6.26(TEST)
NetC35_1: C35.1 U6.2(~{DTR})
NetC35_2: C35.2 ; port RESET
NetJ8_2: R?#10.1 ; port D+
NetJ8_3: R?#9.1 ; port D-
NetR60_1: R60.1 U6.1(TXD)
NetR60_2: R60.2 ; port RX
NetR62_1: R62.1 U6.5(RXD)
NetR62_2: R62.2 ; port TX
NetR?#9_2: R?#9.2 U6.16(USBDM)
NetR?#10_2: R?#10.2 U6.15(USBDP)

Not connected (* = marked no-connect by the designer): U6 3(~{RTS}) 6(~{RI}) 8(NC) 9(~{DSR}) 10(~{DCD}) 11(~{CTS}) 12(CBUS4) 13(CBUS2) 14(CBUS3) 17(3V3OUT) 19(~{RESET}) 22(CBUS1) 23(CBUS0) 24(NC) 27(OSCI) 28(OSCO)

### Notes on the sheet
- (in symbol R0805_22R_1%_0.125W_100PPM) 1%

### Library data of the parts
C34 C35 = 0805C-100nF-25V-X7R-MUR: CAPACITOR 0805 CERAMIC; Supplier 1: Digi-Key; Supplier Part Number 1: 490-1673-1-ND
R60 R62 = 0805R-1K: RESISTOR 0805 1/4 WATT THIN FILM; Reel: *
R?#9 R?#10 = R0805_22R_1%_0.125W_100PPM: Resistor - 1%; Part Description: General Purpose Thick Film Chip Resistor; Manufacturer: GENERIC; Manufacturer1 Part Number: NRC10F22R0TRF; Power: 0.125W; TC: ±100ppm/°C; Table: Resistors SMD; Part Number: R0805_22R_1%_0.125W_100PPM; Component Kind: Standard; Component Type: Standard; Pin Count: 2; Value: 22; Status: Preferred; Tolerance: ±1%; Manufacturer Part Number: R0805_22R_1%_0.125W_100PPM; Case: 0805; Mounted: Yes; Socket: No; SMD: Yes; Manufacturer1 Example: NIC COMPONENT; Manufacturer1 ComponentHeight: 0.6mm; HelpURL: \\cern.ch\dfs\Applications\Altium\Datasheets\R0805_NIC_NRC.pdf; Author: CERN DEM JLC; CreateDate: 03/12/2007; LatestRevisionDate: 13/03/2008
U6 = FT232RL-Reel: USB UART Asynchronous Serial Data Transfer Chip, 28-pin SSOP, Tape and Reel; Manufacturer: FTDI; DatasheetVersion: ver 2.10, Mar-2012; PackageVersion: Mar-12; PackageReference: SSOP-28; PackageDescription: 28-Pin Small Outline Package 0.65 mm Pitch; PartNumber: FT232RL-Reel; ComponentLink1Description: Manufacturer URL; ComponentLink1URL: http://www.ftdichip.com/; ComponentLink2Description: Datasheet; ComponentLink2URL: http://www.ftdichip.com/Support/Documents/DataSheets/ICs/DS_FT232R.pdf

## Sheet eeprom24c32.SchDoc
size A4; DocumentNumber: 7; SheetNumber: 7; SheetTotal: 11
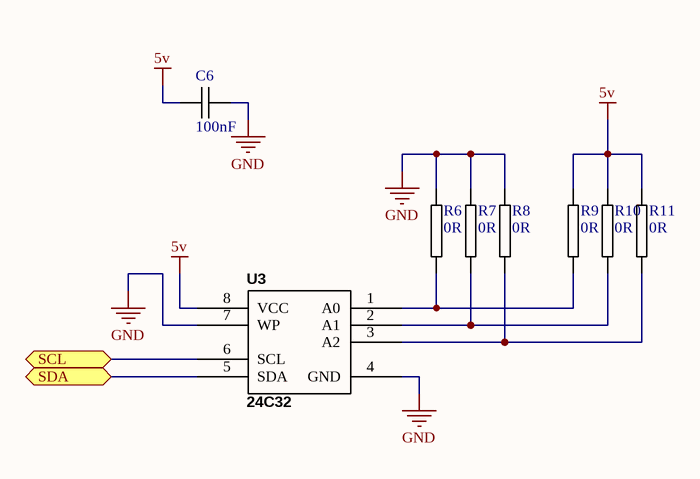
[diagram p6: eeprom24c32.SchDoc]

### Parts
C6  100nF  [0805C-TBD]
R6  0R  [0805R-GENERIC]
R7  0R  [0805R-GENERIC]
R8  0R  [0805R-GENERIC]
R9  0R  [0805R-GENERIC]
R10  0R  [0805R-GENERIC]
R11  0R  [0805R-GENERIC]
U3  24C32  [SO8]

### Ports
SCL, SDA

### Nets
5v: C6.1 R9.2 R10.2 R11.2 U3.8(VCC)
GND: C6.2 R6.2 R7.2 R8.2 U3.4(GND) U3.7(WP)
NetR6_1: R6.1 R9.1 U3.1(A0)
NetR7_1: R7.1 R10.1 U3.2(A1)
NetR8_1: R8.1 R11.1 U3.3(A2)
NetR36_2: U3.6(SCL) ; port SCL
NetR37_2: U3.5(SDA) ; port SDA

### Library data of the parts
C6 = 0805C-100nF-25V-X7R-MUR: CAPACITOR 0805 CERAMIC; Supplier 1: Digi-Key; Supplier Part Number 1: 490-1673-1-ND
R6-R11 = 0805R-0R: RESISTOR 0805 1 WATT
U3 = 24C32: I2C EEPROM 4K X 8; Part Field 1: STM; Manufacturer Part Number: M24C32-WMN6TP; Manufacturer: STMicroelectronics; Description: IC EEPROM 32KBIT 400KHZ 8SOIC; Reel: U3; Part Field 2: M24C32-WMN6TP; Part Field 3: Digi-Key; Part Field 4: 497-5027-6-ND; Part Field 5: SERIAL I2C EEPROM; Supplier 1: Digi-Key; Supplier Part Number 1: 497-5027-2-ND

## Sheet RTC_ds1307z.SchDoc
size A4; DocumentNumber: 9; SheetNumber: 9; SheetTotal: 11
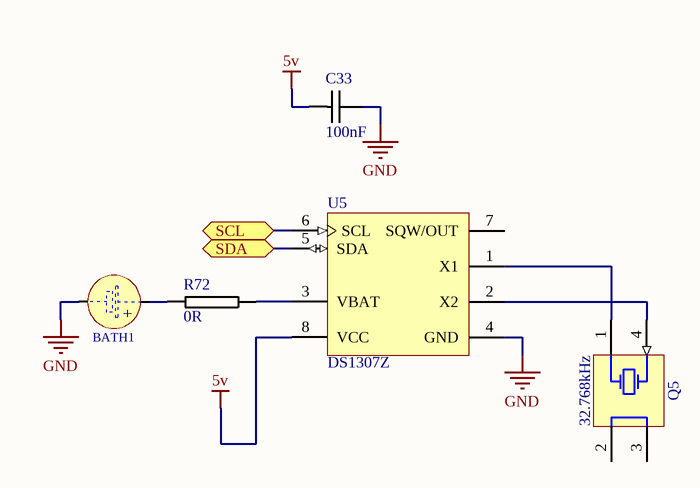
[diagram p7: RTC_ds1307z.SchDoc]

### Parts
BATH1  (no value)  [BATH_KEYSTONE_103]
C33  100nF  [0805C-TBD]
Q5  32.768kHz  [XTAL_EPSON_MC-406]
R72  0R  [0805R-GENERIC]
U5  DS1307Z  [S8-2_N]

### Ports
SCL, SDA

### Nets
5v: C33.1 U5.8(VCC)
GND: BATH1.2(MINUS) C33.2 U5.4(GND)
NetBATH1_1: BATH1.1(PLUS) R72.1
NetQ5_1: Q5.1(X) U5.1(X1)
NetQ5_4: Q5.4(X) U5.2(X2)
NetR36_2: U5.6(SCL) ; port SCL
NetR37_2: U5.5(SDA) ; port SDA
NetR72_2: R72.2 U5.3(VBAT)

Not connected (* = marked no-connect by the designer): Q5 2(GND) 3(GND); U5 7(SQW/OUT)

### Notes on the sheet
- (in symbol BATH_KEYSTONE_103) +

### Library data of the parts
BATH1 = BATH_KEYSTONE_103: Battery Holder whit 2 Pin; Part Description: Battery Holders for 20mm Lithium Coin Cells; Manufacturer Part Number: 103; Table: Batteries; Part Number: BATH_KEYSTONE_103; Component Kind: Standard; Component Type: Standard; Pin Count: 2; PackageDescription: Battery Holders for 20mm Lithium Coin Cells; Family: Battery; Mounted: Yes; Socket: No; SMD: No; Manufacturer: KEYSTONE; ComponentHeight: 8.5mm; HelpURL: \\cern.ch\dfs\Applications\Altium\Datasheets\BATH_KEYSTONE_103.pdf; Author: CERN DEM JLC; CreateDate: 20/10/2009; LatestRevisionDate: 20/10/2009
C33 = 0805C-100nF-25V-X7R-MUR: CAPACITOR 0805 CERAMIC; Supplier 1: Digi-Key; Supplier Part Number 1: 490-1673-1-ND
Q5 = XTAL_32.768KHZ_EPSON_MC-406 32.768K-A3:ROHS: Crystal 4 pins 1=XTAL Control 2 And 3=NC 4=XTAL; Part Description: Load capacitance 12.5pF, Frequency Tolerance ±20 ppm, 40°C to 85°C, Surface Mount Quartz Crystal, MC-406 Serie; Manufacturer: EPSON TOYOCOM; Table: Crystals & Oscillators; Part Number: XTAL_32.768KHZ_EPSON_MC-406 32.768K-A3:ROHS; Component Kind: Standard; Component Type: Standard; PackageDescription: EPSON Crystal; 10.41mm L X 4.06mm W X 3.6mm H; Value: 32.768kHz; Manufacturer Part Number: MC-406 32.768K-A3:ROHS; Pin Count: 4; Mounted: Yes; Socket: No; SMD: Yes; ComponentHeight: 3.6mm; HelpURL: \\cern.ch\dfs\Applications\Altium\Datasheets\XTAL_EPSON_MC-406.pdf; Author: CERN DEM JLC; CreateDate: 27/03/2012; LatestRevisionDate: 30/01/2013
R72 = 0805R-0R: RESISTOR 0805 1 WATT
U5 = DS1307Z: 64 x 8, Serial, I2C Real-Time Clock, 5.0V, 8-Pin SO, 0 to 70 degC; DatasheetVersion: 10-Feb-2008; PackageVersion: revC, 2010; PackageReference: S8-2; PackageDescription: 8-Pin Small-Outline IC, Narrow (0.15in), 1.27 mm Pitch, SOIC (N); Code_JEDEC: MS-012-AA; Code_IPC: SOIC127P600-8; ComponentLink1Description: Manufacturer URL; ComponentLink1URL: http://www.maxim-ic.com; ComponentLink2Description: Datasheet; ComponentLink2URL: http://datasheets.maxim-ic.com/en/ds/DS1307.pdf; ComponentLink3Description: Package Specification; ComponentLink3URL: http://pdfserv.maxim-ic.com/package_dwgs/21-0041.PDF

## Sheet analog.SchDoc
size A4
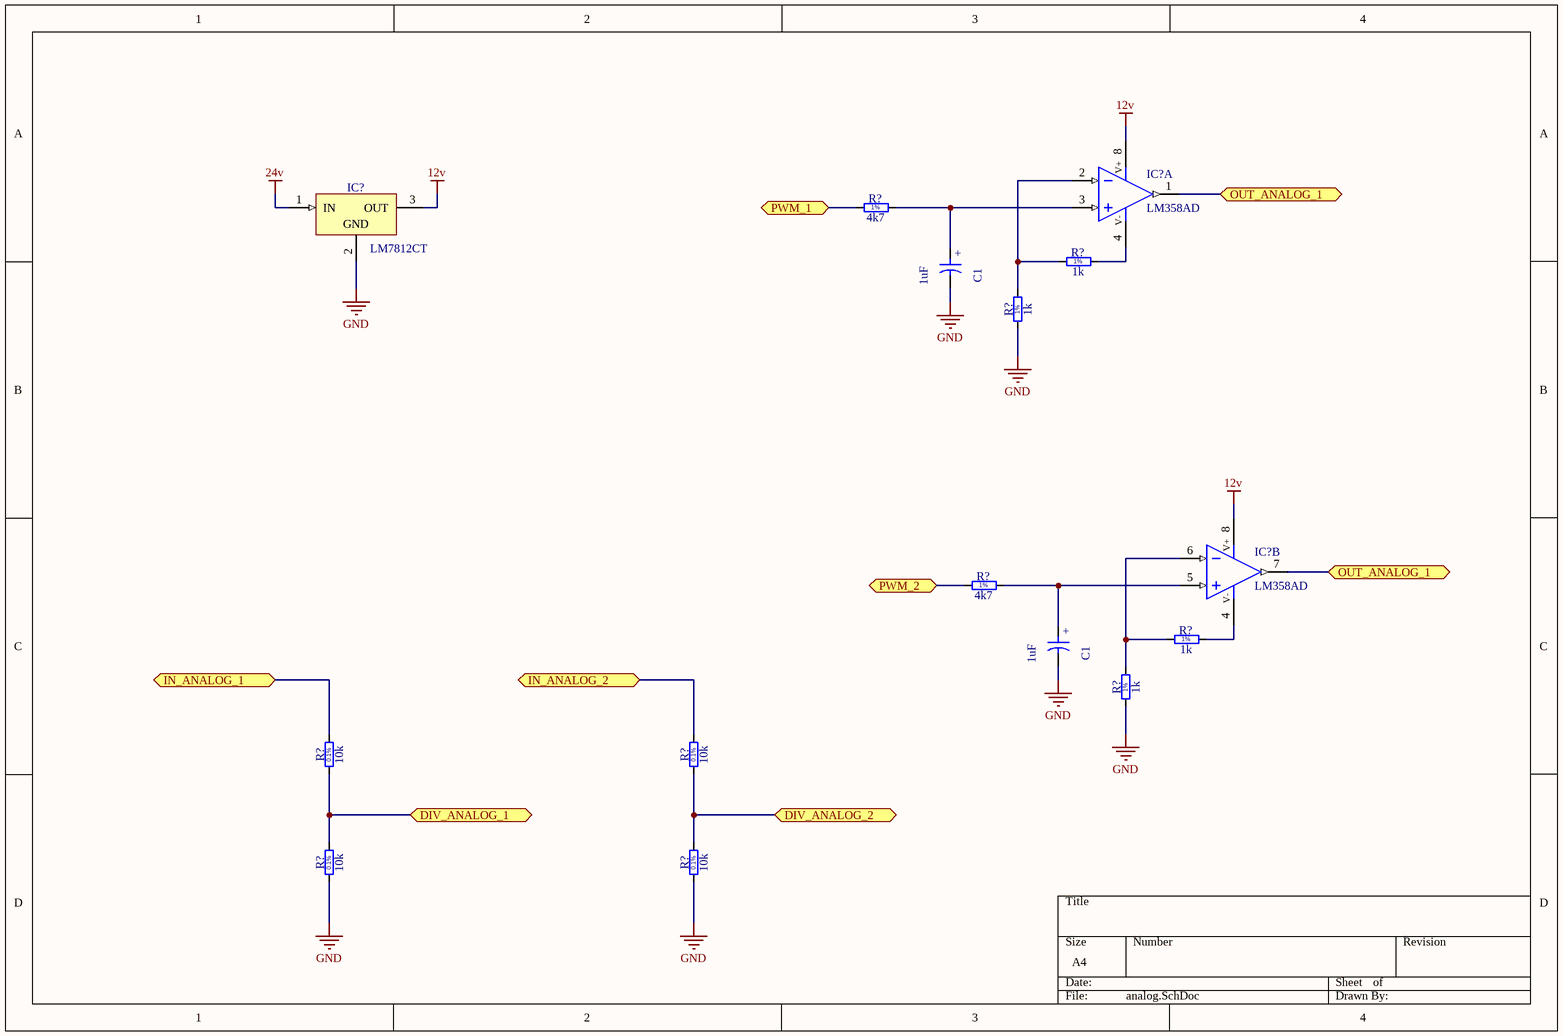
[diagram p8: analog.SchDoc]

### Parts
(Parts that share a designator on the sheet are numbered #1, #2 ... from top to bottom, then left to right.)
C1#5  1uF  [CAPPRB254-450X710]
C1#6  1uF  [CAPPRB254-450X710]
IC?#1  LM358AD  [SOIC127P600X175-8N]  (part A of 2)
IC?#2  LM7812CT  [TO-220-V]
IC?#3  LM358AD  [SOIC127P600X175-8N]  (part B of 2)
R?#11  4k7  [RESC2012X60N]
R?#12  1k  [RESC2012X60N]
R?#13  1k  [RESC2012X60N]
R?#14  4k7  [RESC2012X60N]
R?#15  1k  [RESC2012X60N]
R?#16  1k  [RESC2012X60N]
R?#17  10k  [RESC2012X60N]
R?#18  10k  [RESC2012X60N]
R?#19  10k  [RESC2012X60N]
R?#20  10k  [RESC2012X60N]

### Ports
DIV_ANALOG_1, DIV_ANALOG_2, IN_ANALOG_1, IN_ANALOG_2, OUT_ANALOG_1, PWM_1, PWM_2

### Nets
12v: IC?#1.8(V+) IC?#2.3(OUT) IC?#3.8(V+)
24v: IC?#2.1(IN)
GND: C1#5.2 C1#6.2 IC?#2.2(GND) R?#13.1 R?#16.1 R?#19.1 R?#20.1
NetC1#5_1: C1#5.1 IC?#1.3(IN+) R?#11.2
NetC1#6_1: C1#6.1 IC?#3.5(IN+) R?#14.2
NetIC?#1_1: IC?#1.1(OUT) IC?#3.7(OUT) ; port OUT_ANALOG_1
NetIC?#1_2: IC?#1.2(IN-) R?#12.1 R?#13.2
NetIC?#1_4: IC?#1.4(V-) R?#12.2
NetIC?#3_4: IC?#3.4(V-) R?#15.2
NetIC?#3_6: IC?#3.6(IN-) R?#15.1 R?#16.2
NetR?#11_1: R?#11.1 ; port PWM_1
NetR?#14_1: R?#14.1 ; port PWM_2
NetR?#17_1: R?#17.1 R?#19.2 ; port DIV_ANALOG_1
NetR?#17_2: R?#17.2 ; port IN_ANALOG_1
NetR?#18_1: R?#18.1 R?#20.2 ; port DIV_ANALOG_2
NetR?#18_2: R?#18.2 ; port IN_ANALOG_2

### Notes on the sheet
- (in symbol CTEB_1UF_35V_10%_254-450X710) +
- (in symbol R0805_1K_1%_0.33W_100PPM_VISHAY_CRCW-HP) 1%
- (in symbol R0805_4K7_1%_0.125W_100PPM) 1%
- (in symbol R0805_10K_0.1%_0.1W_10PPM) 0.1%

### Library data of the parts
C1#5 C1#6 = CTEB_1UF_35V_10%_254-450X710: as C1#1 on sheet Comu_485; Part Number: CTEB_1UF_35V_10%_254-450X710; Component Kind: Standard; Component Type: Standard; Pin Count: 2; Value: 1uF; Status: None; Case: LS2.54 D4.5 x H7.1; Mounted: Yes; Socket: No; SMD: No; ComponentHeight: 7.1mm; HelpURL: \\cern.ch\dfs\Applications\Altium\Datasheets\CTEB_KEMET_T350.pdf; Author: CERN DEM JLC; CreateDate: 16/12/2009; LatestRevisionDate: 16/12/2009
IC?#1 IC?#3 = LM358AD: Dual Operational Amplifier; Manufacturer: TEXAS INSTRUMENTS; Table: Operational Amplifiers; Part Number: LM358AD; Component Kind: Standard; Component Type: Standard; Device: LM358AD; PackageDescription: SOIC 8, Pitch 1.27mm - Body 4x5mm, IPC Medium Density; Part Description: Dual Operational Amplifier; Manufacturer Part Number: LM358AD; Pin Count: 8; Case: SOIC8; Mounted: Yes; Socket: No; SMD: Yes; ComponentHeight: 1.75mm; Author: CERN DEM JLC; HelpURL: \\cern.ch\dfs\Applications\Altium\Datasheets\LM358AD.pdf; CreateDate: 02/12/2008; LatestRevisionDate: 13/04/2010
IC?#2 = LM7812CT_v: 3-Terminal Regulator 1=IN 2=GND 3=OUT; Part Description: 3-Terminal 12V 1A Positive Voltage Regulator; Manufacturer: FAIRCHILD SEMICONDUCTOR; Table: Regulators; Part Number: LM7812CT_v; Component Kind: Standard; Component Type: Standard; Device: LM7812CT; PackageDescription: TO-220 3-Terminal + Tab - Horizontal Mount; Manufacturer Part Number: LM7812CT; Pin Count: 3; Case: TO-220; Mounted: Yes; Socket: No; SMD: No; ComponentHeight: 18.95mm; HelpURL: \\cern.ch\dfs\Applications\Altium\Datasheets\LM7812CT.pdf; Author: CERN DEM JLC; CreateDate: 29/10/2008; LatestRevisionDate: 29/10/2008
R?#11 R?#14 = R0805_4K7_1%_0.125W_100PPM: Resistor - 1%; Part Description: General Purpose Thick Film Chip Resistor; Manufacturer: GENERIC; Manufacturer1 Part Number: NRC10F4701TRF; Power: 0.125W; TC: ±100ppm/°C; Table: Resistors SMD; Part Number: R0805_4K7_1%_0.125W_100PPM; Component Kind: Standard; Component Type: Standard; Pin Count: 2; Value: 4k7; Status: Preferred; Tolerance: ±1%; Manufacturer Part Number: R0805_4K7_1%_0.125W_100PPM; Case: 0805; Mounted: Yes; Socket: No; SMD: Yes; Manufacturer1 Example: NIC COMPONENT; Manufacturer1 ComponentHeight: 0.6mm; HelpURL: \\cern.ch\dfs\Applications\Altium\Datasheets\R0805_NIC_NRC.pdf; Author: CERN DEM JLC; CreateDate: 03/12/2007; LatestRevisionDate: 13/03/2008
R?#12 R?#13 R?#15 R?#16 = R0805_1K_1%_0.33W_100PPM_VISHAY_CRCW-HP: Resistor - 1%; Part Description: Pulse Proof, High Power Thick Film Chip Resistor; Manufacturer: VISHAY; Manufacturer Part Number: CRCW08051K00FKEAHP; Power: 0.33W; TC: ±100ppm/°C; Table: Resistors SMD; Part Number: R0805_1K_1%_0.33W_100PPM_VISHAY_CRCW-HP; Component Kind: Standard; Component Type: Standard; Pin Count: 2; Value: 1k; Status: None; Tolerance: ±1%; Case: 0805; Mounted: Yes; Socket: No; SMD: Yes; Manufacturer1 ComponentHeight: 0.6mm; HelpURL: \\cern.ch\dfs\Applications\Altium\Datasheets\R0805_VISHAY_CRCW-HP e3.pdf; Author: CERN DEM JLC; CreateDate: 16/06/2010; LatestRevisionDate: 16/06/2010
R?#17-R?#20 = R0805_10K_0.1%_0.1W_10PPM: Resistor - 0.1%; Part Description: Thin Film Chip Resistor; Manufacturer: GENERIC; Manufacturer1 Part Number: RN73C2A10KBTG; Power: 0.1W; TC: ±10ppm; Table: Resistors SMD; Part Number: R0805_10K_0.1%_0.1W_10PPM; Component Kind: Standard; Component Type: Standard; Pin Count: 2; Value: 10k; Status: Not recommended; Tolerance: ±0.1%; Manufacturer Part Number: R0805_10K_0.1%_0.1W_10PPM; Case: 0805; Mounted: Yes; Socket: No; SMD: Yes; Manufacturer1 Example: TYCO HOLSWORTHY; Manufacturer1 ComponentHeight: 0.6mm; HelpURL: \\cern.ch\dfs\Applications\Altium\Datasheets\R0805_Tyco_RN73.pdf; Author: CERN DEM JLC; CreateDate: 03/12/2007; LatestRevisionDate: 13/03/2008

## Sheet conn.SchDoc
size A4; DocumentNumber: 11; SheetNumber: 11; SheetTotal: 11
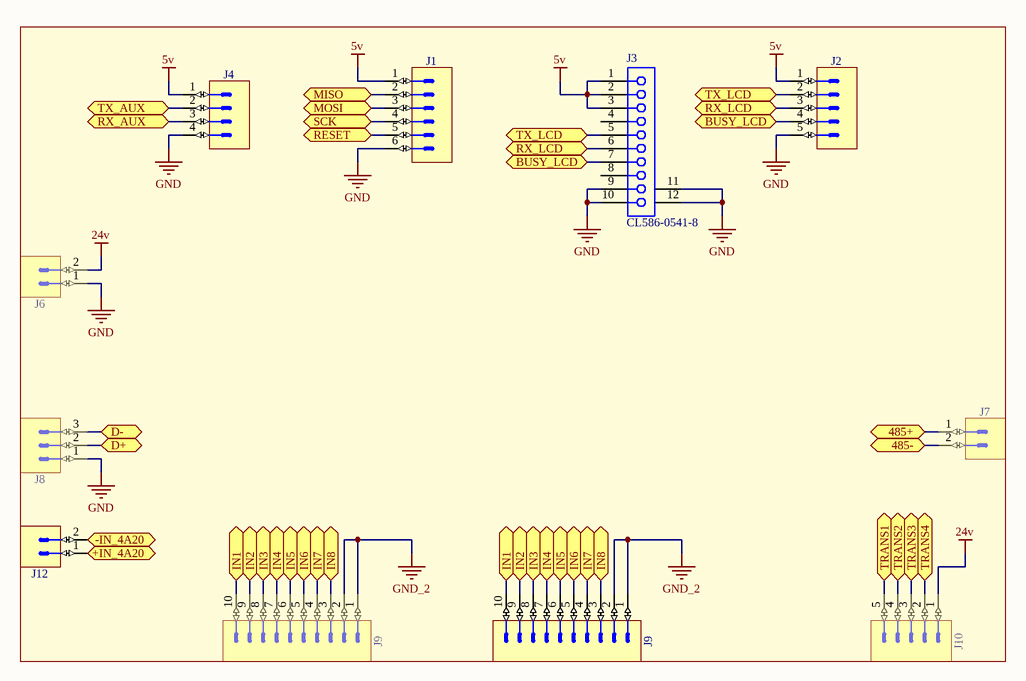
[diagram p9: conn.SchDoc]

### Parts
(Parts that share a designator on the sheet are numbered #1, #2 ... from top to bottom, then left to right.)
J1  KK®  [MOLEX_22-27-2061]  (value not drawn)
J2  KK®  [MOLEX_22-27-2051]  (value not drawn)
J3  CL586-0541-8  [FH12-22(10)SA-1SH]
J4  KK®  [MOLEX_22-27-2041]  (value not drawn)
J6  (no value)  [PHOENIX_1757242]
J7  (no value)  [PHOENIX_1757242]
J8  (no value)  [PHOENIX_1757255]
J9#1  (no value)  [PHOENIX_1757323]
J9#2  (no value)  [PHOENIX_1757323]
J10  (no value)  [PHOENIX_1757271]
J12  (no value)  [PHOENIX_1757242]

### Ports
485+, 485-, +IN_4A20, -IN_4A20, BUSY_LCD, D+, D-, IN1, IN2, IN3, IN4, IN5, IN6, IN7, IN8, MISO, MOSI, RESET, RX_AUX, RX_LCD, SCK, TRANS1, TRANS2, TRANS3, TRANS4, TX_AUX, TX_LCD

### Nets
5v: J1.1 J2.1 J3.1 J3.2 J3.3 J4.1
24v: J6.2 J10.1
GND: J1.6 J2.5 J3.9 J3.10 J3.11(MH1) J3.12(MH2) J4.4 J6.1 J8.1
GND_2: J9#1.1 J9#1.2 J9#2.1 J9#2.2
NetC35_2: J1.5 ; port RESET
NetD17#1_2: J10.5 ; port TRANS1
NetD18#1_2: J10.3 ; port TRANS3
NetD19#1_2: J10.4 ; port TRANS2
NetD20#1_2: J10.2 ; port TRANS4
NetJ1_2: J1.2 ; port MISO
NetJ1_3: J1.3 ; port MOSI
NetJ1_4: J1.4 ; port SCK
NetJ2_2: J2.2 J3.5 ; port TX_LCD
NetJ2_3: J2.3 J3.6 ; port RX_LCD
NetJ2_4: J2.4 J3.7 ; port BUSY_LCD
NetJ4_2: J4.2 ; port TX_AUX
NetJ4_3: J4.3 ; port RX_AUX
NetJ7_1: J7.1 ; port 485+
NetJ7_2: J7.2 ; port 485-
NetJ8_2: J8.2 ; port D+
NetJ8_3: J8.3 ; port D-
NetJ9#1_3: J9#1.3 J9#2.3 ; port IN8
NetJ9#1_4: J9#1.4 J9#2.4 ; port IN7
NetJ9#1_5: J9#1.5 J9#2.5 ; port IN6
NetJ9#1_6: J9#1.6 J9#2.6 ; port IN5
NetJ9#1_7: J9#1.7 J9#2.7 ; port IN4
NetJ9#1_8: J9#1.8 J9#2.8 ; port IN3
NetJ9#1_9: J9#1.9 J9#2.9 ; port IN2
NetJ9#1_10: J9#1.10 J9#2.10 ; port IN1
NetJ12_1: J12.1 ; port +IN_4A20
NetJ12_2: J12.2 ; port -IN_4A20

Not connected (* = marked no-connect by the designer): J3 4 8

### Library data of the parts
J1 = MOLEX_22-27-2061: Connector 6 Male; Part Description: 2.54mm (.100") Pitch KK® Wire-to-Board Header, Vertical, with Friction Lock, 6 Circuits, Tin (Sn) Plating; Manufacturer: MOLEX; Part Number: MOLEX_22-27-2061; Component Kind: Standard; Component Type: Standard; Pin Count: 6; Family: KK®; Mounted: Yes; Socket: No; SMD: No; Status: None; Manufacturer Part Number: 22-27-2061; ComponentHeight: 11.7mm; HelpURL: \\cern.ch\dfs\Applications\Altium\Datasheets\MOLEX_22-27-2061.pdf; Author: CERN DEM JMW; CreateDate: 30/11/2011; LatestRevisionDate: 30/11/2011; Table: MOLEX
J2 = MOLEX_22-27-2051: Connector 5 Male; Part Description: 2.54mm (.100") Pitch KK® Wire-to-Board Header, Vertical, with Friction Lock, 5 Circuits, Tin (Sn) Plating; Manufacturer: MOLEX; Part Number: MOLEX_22-27-2051; Component Kind: Standard; Component Type: Standard; Pin Count: 5; Family: KK®; Mounted: Yes; Socket: No; SMD: No; Status: None; Manufacturer Part Number: 22-27-2051; ComponentHeight: 11.7mm; HelpURL: \\cern.ch\dfs\Applications\Altium\Datasheets\MOLEX_22-27-2051.pdf; Author: CERN DEM JLC; CreateDate: 04/12/2008; LatestRevisionDate: 04/12/2008; Table: MOLEX
J3 = CL586-0541-8: FH12 Series, "Flip-Lock" SMT/ZIF FFC/FPC Connector - 1.0mm Spaced Bottom Eccentric Contact; Positions: 10; ContactMaterial: Phosphor Bronze; Current: 0.5A; PCB_Layout: Complies with manufacturer's recommendation.; Note: Pad dimensions follow nominal values, Suitable for Wave Soldering, Adjust for Re-flow.; Published: 17-Jul-2002; DatasheetVersion: 13-Nov-2000; PackageVersion: 13-Nov-2000; PackageReference: FH12-22(10)SA-1SH; Publisher: Altium Limited; ComponentLink1Description: Manufacturer Link; ComponentLink1URL: http://www.hiroseusa.com/; ComponentLink2Description: Datasheet; ComponentLink2URL: http://www.hirose.co.jp/cataloge_hp/e58605370.pdf
J4 = MOLEX_22-27-2041: Connector 4 Male; Part Description: 2.54mm (.100") Pitch KK® Wire-to-Board Header, Vertical, with Friction Lock, 4 Circuits, Tin (Sn) Plating; Manufacturer: MOLEX; Part Number: MOLEX_22-27-2041; Component Kind: Standard; Component Type: Standard; Pin Count: 4; Family: KK®; Mounted: Yes; Socket: No; SMD: No; Status: None; Manufacturer Part Number: 22-27-2041; ComponentHeight: 11.7mm; HelpURL: \\cern.ch\dfs\Applications\Altium\Datasheets\MOLEX_22-27-2041.pdf; Author: CERN DEM JLC; CreateDate: 04/12/2008; LatestRevisionDate: 04/12/2008; Table: MOLEX
J6 J7 J12 = PHOENIX_1757242: Connector 2 Male; Part Description: 12A, 250V, Pitch 5.08mm, 2 Positions Header; Manufacturer: PHOENIX CONTACT; Manufacturer Part Number: 1757242 (MSTBA 2,5/ 2-G-5,08); Part Number: PHOENIX_1757242; Component Kind: Standard; Component Type: Standard; Pin Count: 2; Mounted: Yes; Socket: No; SMD: No; Status: None; ComponentHeight: 8.6mm; HelpURL: \\cern.ch\dfs\Applications\Altium\Datasheets\PHOENIX_1757242.pdf; Author: CERN DEM JLC; CreateDate: 10/02/2010; LatestRevisionDate: 26/04/2010; Table: PHOENIX
J8 = PHOENIX_1757255: Connector 3 Male; Part Description: 12A, 250V, Pitch 5.08mm, 3 Positions Header; Manufacturer: PHOENIX CONTACT; Manufacturer Part Number: 1757255 (MSTBA 2,5/ 3-G-5,08); Part Number: PHOENIX_1757255; Component Kind: Standard; Component Type: Standard; Pin Count: 3; Mounted: Yes; Socket: No; SMD: No; Status: None; ComponentHeight: 8.6mm; HelpURL: \\cern.ch\dfs\Applications\Altium\Datasheets\PHOENIX_1757255.pdf; Author: CERN DEM JLC; CreateDate: 10/02/2010; LatestRevisionDate: 26/04/2010; Table: PHOENIX
J9#1 J9#2 = PHOENIX_1757323: Connector 10 Male; Part Description: 12A, 250V, Pitch 5.08mm, 10 Positions Header; Manufacturer: PHOENIX CONTACT; Manufacturer Part Number: 1757323 (MSTBA 2,5/ 10-G-5,08); Part Number: PHOENIX_1757323; Component Kind: Standard; Component Type: Standard; Pin Count: 10; Mounted: Yes; Socket: No; SMD: No; Status: None; ComponentHeight: 8.6mm; HelpURL: \\cern.ch\dfs\Applications\Altium\Datasheets\PHOENIX_1757323.pdf; Author: CERN DEM JLC; CreateDate: 10/02/2010; LatestRevisionDate: 26/04/2010; Table: PHOENIX
J10 = PHOENIX_1757271: Connector 5 Male; Part Description: 12A, 250V, Pitch 5.08mm, 5 Positions Header; Manufacturer: PHOENIX CONTACT; Manufacturer Part Number: 1757271 (MSTBA 2,5/ 5-G-5,08); Part Number: PHOENIX_1757271; Component Kind: Standard; Component Type: Standard; Pin Count: 5; Mounted: Yes; Socket: No; SMD: No; Status: None; ComponentHeight: 8.6mm; HelpURL: \\cern.ch\dfs\Applications\Altium\Datasheets\PHOENIX_1757271.pdf; Author: CERN DEM JLC; CreateDate: 10/02/2010; LatestRevisionDate: 26/04/2010; Table: PHOENIX

## Nets that join several sheets
5v: Microcontrolador (12 pins), Output_dig (12 pins), Output_dig2 (16 pins), Input_dig (24 pins), Comu_485 (8 pins), USB_SERIAL (C34.1 U6.4 U6.20), eeprom24c32 (5 pins), RTC_ds1307z (C33.1 U5.8), conn (6 pins)
24v: Output_dig (D17#1.1 D18#1.1 D19#1.1 D20#1.1), Output_dig2 (D17#2.1 D18#2.1 D19#2.1 D20#2.1), analog (IC?#2.1), conn (J6.2 J10.1)
GND: Microcontrolador (11 pins), Output_dig (12 pins), Output_dig2 (16 pins), Input_dig (8 pins), Comu_485 (8 pins), USB_SERIAL (6 pins), eeprom24c32 (6 pins), RTC_ds1307z (BATH1.2 C33.2 U5.4), analog (7 pins), conn (9 pins)
GND_2: Input_dig (8 pins), conn (J9#1.1 J9#1.2 J9#2.1 J9#2.2)
NetC35_2: Microcontrolador (R38.1), USB_SERIAL (C35.2), conn (J1.5)
NetD17#1_2: Output_dig (D17#1.2 Q1#1.2), conn (J10.5)
NetD18#1_2: Output_dig (D18#1.2 Q2#1.2), conn (J10.3)
NetD19#1_2: Output_dig (D19#1.2 Q3#1.2), conn (J10.4)
NetD20#1_2: Output_dig (D20#1.2 Q4#1.2), conn (J10.2)
NetIC2_6: Microcontrolador (U4.18), Input_dig (IC2.6 R12.2)
NetIC3_6: Microcontrolador (U4.7), Input_dig (IC3.6 R13.2)
NetIC4_6: Microcontrolador (U4.17), Input_dig (IC4.6 R18.2)
NetIC5_6: Microcontrolador (U4.6), Input_dig (IC5.6 R19.2)
NetIC6_6: Microcontrolador (U4.16), Input_dig (IC6.6 R24.2)
NetIC7_6: Microcontrolador (U4.5), Input_dig (IC7.6 R25.2)
NetIC9_6: Microcontrolador (U4.1), Input_dig (IC9.6 R31.2)
NetJ1_2: Microcontrolador (U4.22), conn (J1.2)
NetJ1_3: Microcontrolador (U4.21), conn (J1.3)
NetJ1_4: Microcontrolador (U4.20), conn (J1.4)
NetJ2_2: Microcontrolador (U4.46), conn (J2.2 J3.5)
NetJ2_3: Microcontrolador (U4.45), conn (J2.3 J3.6)
NetJ2_4: Microcontrolador (U4.50), conn (J2.4 J3.7)
NetJ7_1: Comu_485 (R2#1.2 R2#2.2), conn (J7.1)
NetJ7_2: Comu_485 (R4#1.2 R4#2.2), conn (J7.2)
NetJ8_2: USB_SERIAL (R?#10.1), conn (J8.2)
NetJ8_3: USB_SERIAL (R?#9.1), conn (J8.3)
NetJ9#1_3: Input_dig (R?#8.1), conn (J9#1.3 J9#2.3)
NetJ9#1_4: Input_dig (R?#6.1), conn (J9#1.4 J9#2.4)
NetJ9#1_5: Input_dig (R?#4.1), conn (J9#1.5 J9#2.5)
NetJ9#1_6: Input_dig (R?#2.1), conn (J9#1.6 J9#2.6)
NetJ9#1_7: Input_dig (R?#7.1), conn (J9#1.7 J9#2.7)
NetJ9#1_8: Input_dig (R?#5.1), conn (J9#1.8 J9#2.8)
NetJ9#1_9: Input_dig (R?#3.1), conn (J9#1.9 J9#2.9)
NetJ9#1_10: Input_dig (R?#1.1), conn (J9#1.10 J9#2.10)
NetR36_2: Microcontrolador (R36.2 U4.43), eeprom24c32 (U3.6), RTC_ds1307z (U5.6)
NetR37_2: Microcontrolador (R37.2 U4.44), eeprom24c32 (U3.5), RTC_ds1307z (U5.5)
NetR42#1_1: Microcontrolador (U4.26), Output_dig (R42#1.1)
NetR43#1_1: Microcontrolador (U4.24), Output_dig (R43#1.1)
NetR48#1_1: Microcontrolador (U4.25), Output_dig (R48#1.1)
NetR49#1_1: Microcontrolador (U4.23), Output_dig (R49#1.1)
NetR60_2: Microcontrolador (U4.2), USB_SERIAL (R60.2)
NetR62_2: Microcontrolador (U4.3), USB_SERIAL (R62.2)
NetU2#1_1: Microcontrolador (U4.63), Comu_485 (U2#1.1)
NetU2#1_2: Microcontrolador (U4.70), Comu_485 (U2#1.2 U2#1.3)
NetU2#1_4: Microcontrolador (U4.64), Comu_485 (U2#1.4)
NetU2#2_1: Microcontrolador (U4.12), Comu_485 (U2#2.1)
NetU2#2_2: Microcontrolador (U4.15), Comu_485 (U2#2.2 U2#2.3)
NetU2#2_4: Microcontrolador (U4.13), Comu_485 (U2#2.4)